# EasyEDA schematic 1-Schematic_MOBO_V3.json
TITLE: Sheet_1; REV: 1.0; Date: 2020-03-11; Sheet: 1/1; Drawn By: baddy227; Company: Your Company
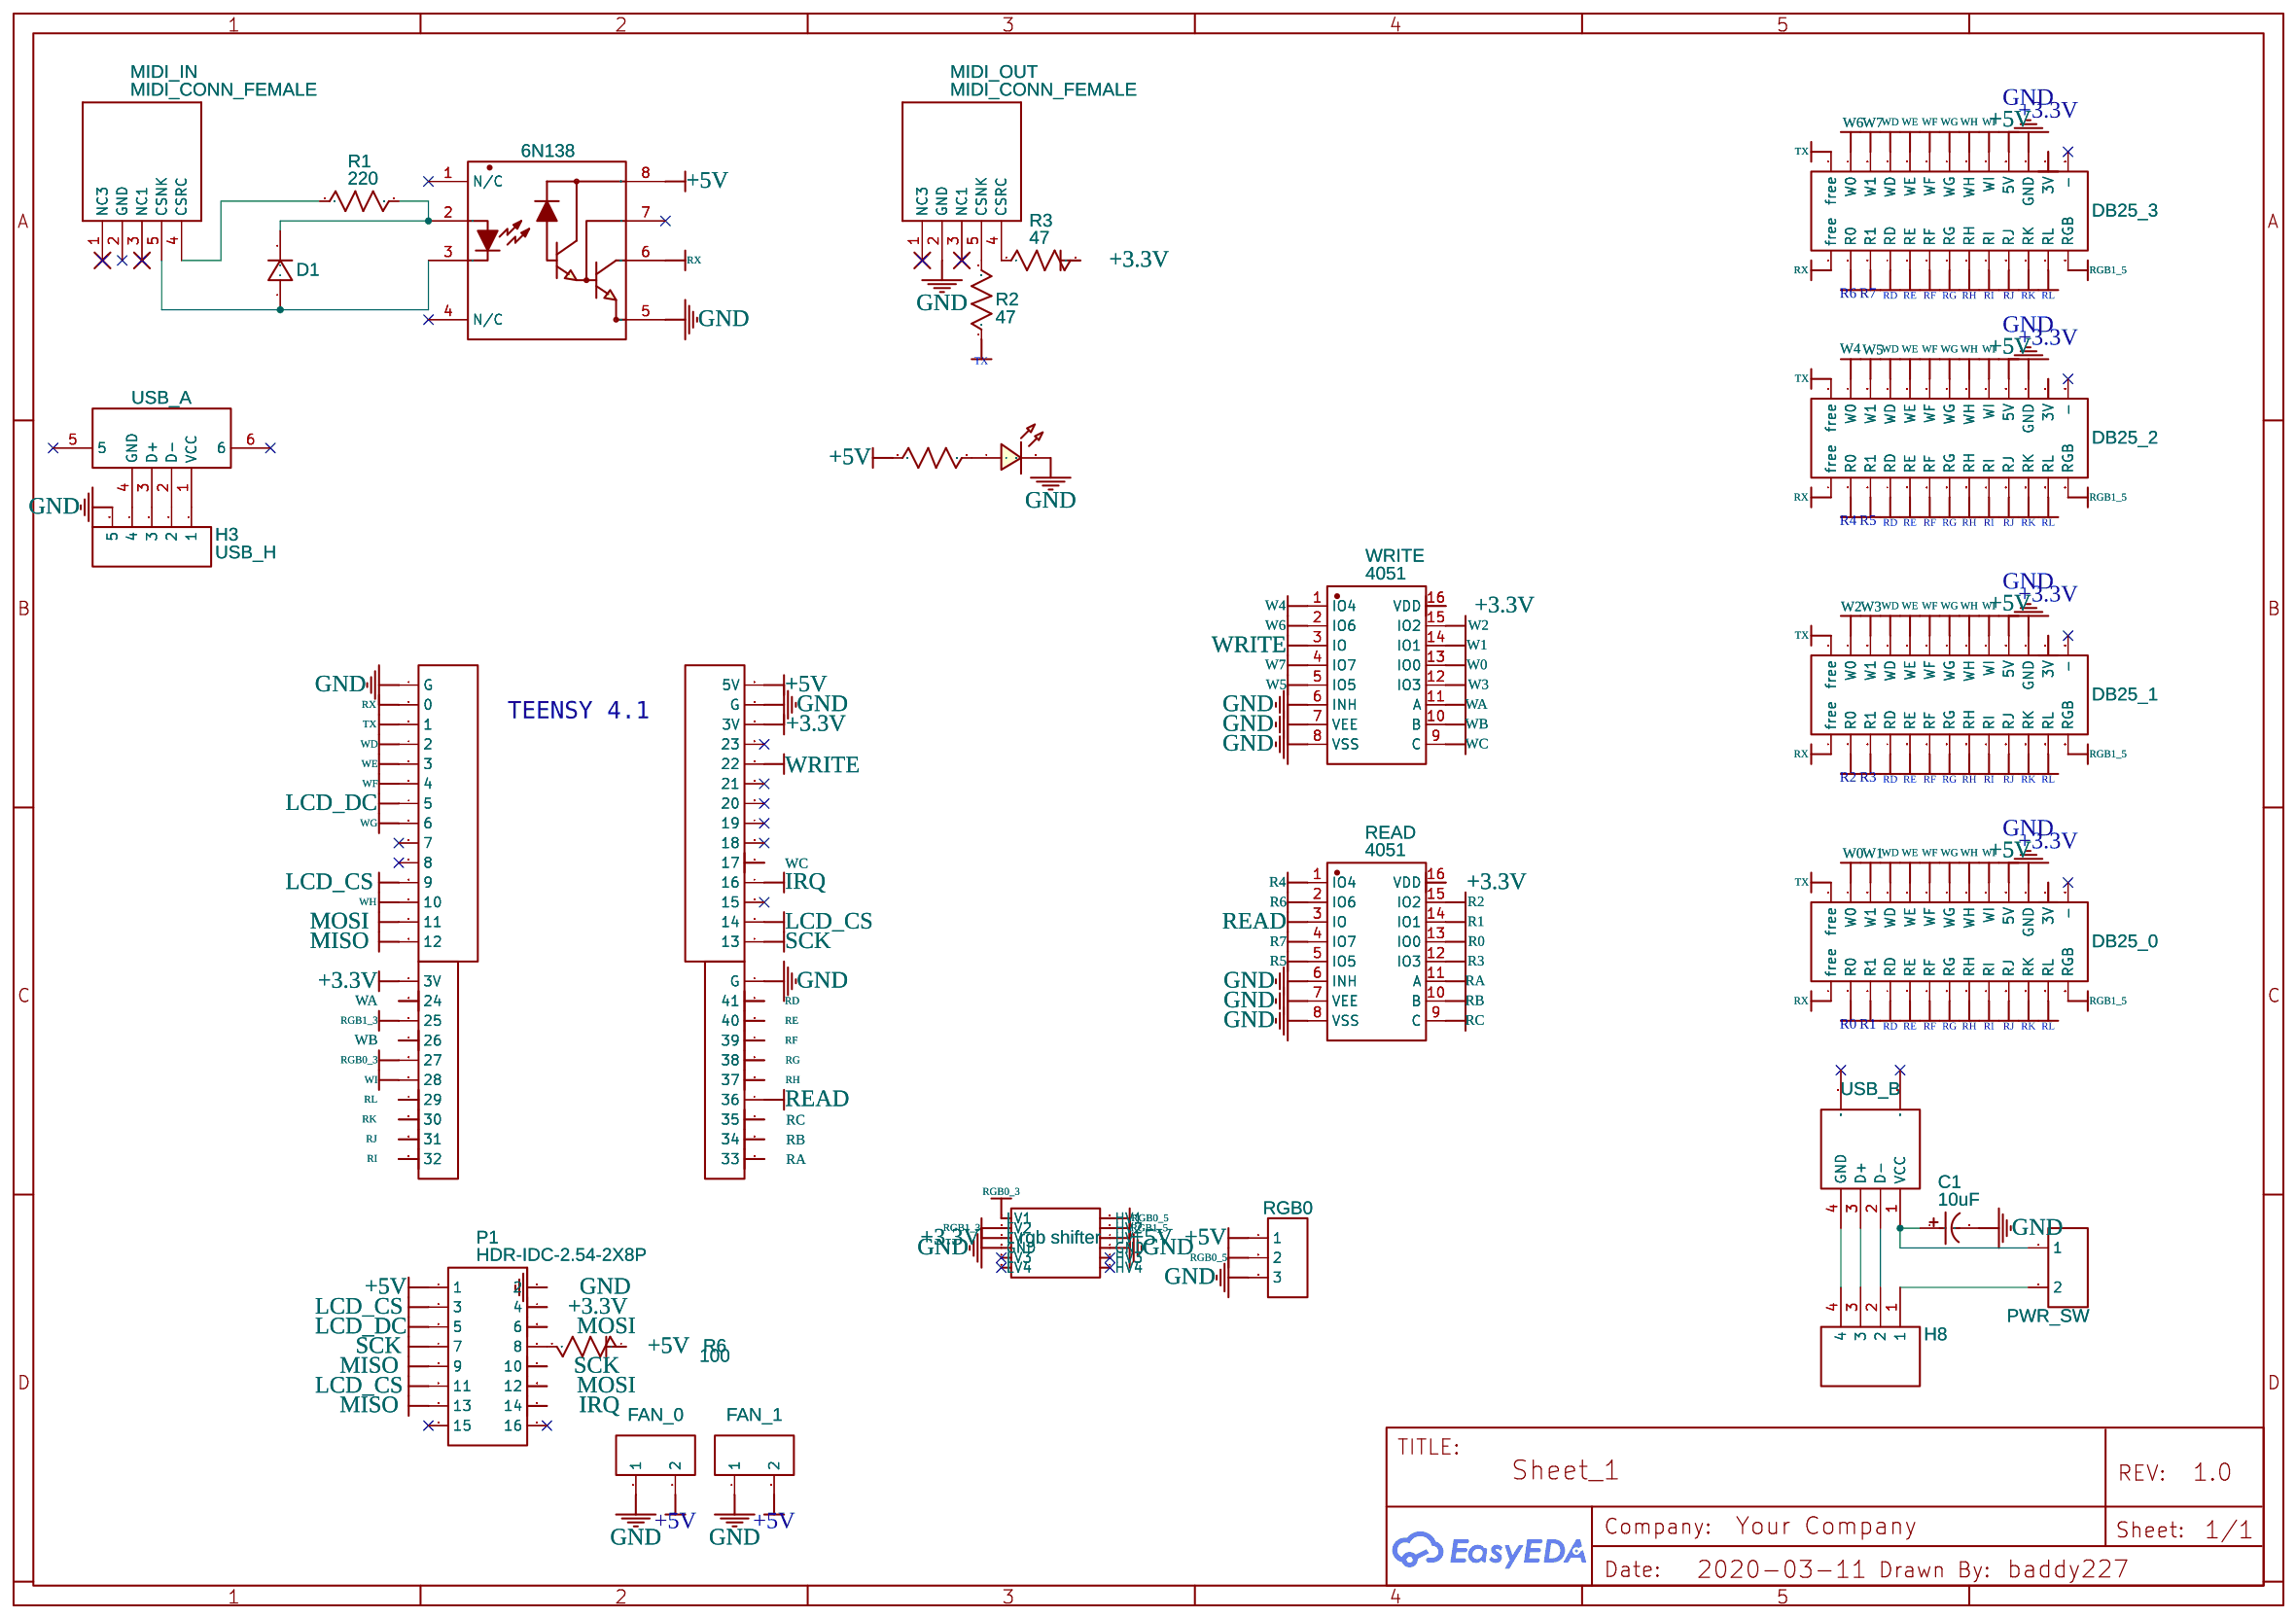
[diagram p0: schematic sheet]

## Parts
6N138  6N138  [DIP-8_L9.8-W6.6-P2.54-LS7.6-BL]
C1  10uF  [CAP-TH_BD5.0-P2.5-D0.5-FD]
D1  1N4448  [DO-35]
DB25_0  HDR-IDC-2.54-2X13P  [HDR-IDC-2.54-2X13P]
DB25_1  HDR-IDC-2.54-2X13P  [HDR-IDC-2.54-2X13P]
DB25_2  HDR-IDC-2.54-2X13P  [HDR-IDC-2.54-2X13P]
DB25_3  HDR-IDC-2.54-2X13P  [HDR-IDC-2.54-2X13P]
FAN_0  Header-Male-2.54_1x2  [HDR-2X1/2.54]
FAN_1  Header-Male-2.54_1x2  [HDR-2X1/2.54]
H1  HDR-F-2.54_1x10  [HDR-F-2.54_1X10]
H2  HDR-F-2.54_1x10  [HDR-F-2.54_1X10]
H3  USB_H  [HDR-F-2.54_1X5]
H8  220S-1*4P H=8.5MM Ytype Gold-plated  [DIP-1X4P2.54]
LED1  LED-TH-3mm_R  [LED-TH_BD3.0_RED]
MIDI_IN  MIDI_CONN_FEMALE  [DIN_5_FEMALE]
MIDI_OUT  MIDI_CONN_FEMALE  [DIN_5_FEMALE]
P1  HDR-IDC-2.54-2X8P  [IDC-TH_16P-P2.54_C3406]
PWR_SW  Header-Male-2.54_1x2  [HDR-2X1/2.54]
R1  220  [AXIAL-0.3]
R2  47  [AXIAL-0.3]
R3  47  [AXIAL-0.3]
R4  1k  [R_AXIAL-0.3]
R6  100  [R_AXIAL-0.3]
READ  4051  [DIP-16_L20.0-W6.4-P2.54-LS7.6-BL]
RGB0  Header-Male-2.54_1x3  [HDR-TH_3P-P2.54-V]
T0  Female header 2.54-1*14P  [HDR-TH_14P-P2.54-V]
T1  Female header 2.54-1*14P  [HDR-TH_14P-P2.54-V]
U1  rgb shifter  [4 CHANNEL LOGIC LEVEL SHIFTER BSS138]
USB_A  USB-AF-90-13.6X14.4-H6.95  [USB-A-TH_C42628]
USB_B  USB-B-Female-TH_C46393  [USB-B_4PIN-FEMALE_BF90]
WRITE  4051  [DIP-16_L20.0-W6.4-P2.54-LS7.6-BL]

## Library data of the parts
6N138 = 6N138: Supplier: LCSC; Supplier Part: C255743; Manufacturer: Isocom Components; Contributor: LCSC
C1 = C10uF63V2.5mm5x11mm: Supplier: LCSC; Manufacturer: ReliaPro; Supplier Part: C32455
D1 = 1N4448: Supplier: LCSC; Manufacturer: SEMTECH; image: //image.lceda.cn/szlcsc/C54037.jpg; Supplier Part: C54037
DB25_0-DB25_3 = HDR-IDC-2.54-2X13P: Supplier: LCSC; Manufacturer Part: IDC Box 2.54mm 2X13P Straight; Contributor: LCSC
FAN_0 FAN_1 PWR_SW = Header-Male-2.54_1x2: Supplier: LCSC; Manufacturer: TE Connectivity; Manufacturer Part: 826629-2; image: //image.lceda.cn/szlcsc/C86471.jpg; Supplier Part: C86471
H1 H2 = HDR-F-2.54_1x10: Supplier Part: C35445; Supplier: LCSC; Contributor: LCEDA_Lib
H3 = HDR-F-2.54_1x5: Supplier Part: C50950; Supplier: LCSC; Contributor: LCEDA_Lib
H8 = 220S-1*4P H=8.5MM Ytype Gold-plated: Supplier: LCSC; Manufacturer: Ckmtw; Contributor: LCSC; Supplier Part: C124413
LED1 = LED-TH-3mm_R: Manufacturer: EVERLIGHT(台湾亿光); Manufacturer Part: 204-10SDRD/S530-A3-L; Supplier Part: C84774; Supplier: LCSC; Contributor: LCEDA_Lib
MIDI_IN MIDI_OUT = MIDI_CONN_FEMALE: MIDI connector, no strain relieve (DIN-5 female); Contributor: SparkFun
P1 = HDR-IDC-2.54-2X8P: Supplier: LCSC; Manufacturer: BOOMELE; Manufacturer Part: IDC Box 2.54mm 16P　Straight; image: //image.lceda.cn/szlcsc/C3406.jpg; Supplier Part: C3406
R1-R3 = Res_AXIAL-0.3(1/8W)_US
R4 R6 = R_AXIAL-0.3_US: Contributor: LCEDA_Lib
READ WRITE = CD4051BE: Supplier: LCSC; Manufacturer: TI; image: //image.lceda.cn/szlcsc/C5200.jpg; Supplier Part: C5200
RGB0 = Header-Male-2.54_1x3: Supplier: LCSC; Manufacturer: BOOMELE; Manufacturer Part: Header2.54mm 1*3P; image: //image.lceda.cn/szlcsc/C49257.jpg; Supplier Part: C49257
T0 T1 = Female header 2.54-1*14P: Supplier: LCSC; Manufacturer: BOOMELE; Supplier Part: C52711
U1 = 4 channel logic level shifter bss138: Contributor: abhishek.kool.777
USB_A = USB-AF-90-13.6X14.4-H6.95: Supplier: LCSC; Supplier Part: C42628; Manufacturer: LCSC; Contributor: LCSC
USB_B = USB-B-Female-TH_C46393: Supplier: LCSC; Manufacturer Part: USB-B-Female-90-TH; image: //image.lceda.cn/szlcsc/C46393.jpg; Supplier Part: C46393

## Nets
+3.3V: DB25_0.24(3V) DB25_1.24(3V) DB25_2.24(3V) DB25_3.24(3V) H1.1(3V) P1.4 R3.2 READ.16(VDD) T1.12(3V) U1.9(LV) WRITE.16(VDD)
+5V: 6N138.8(VCC) DB25_0.20(5V) DB25_1.20(5V) DB25_2.20(5V) DB25_3.20(5V) FAN_0.2 FAN_1.2 P1.1 R4.1 R6.1 RGB0.1 T1.14(5V) U1.4(HV)
GND: 6N138.5(GND) C1.2 DB25_0.22(GND) DB25_1.22(GND) DB25_2.22(GND) DB25_3.22(GND) FAN_0.1 FAN_1.1 H2.1(G) H3.5 LED1.2 MIDI_OUT.2(GND) P1.2 READ.6(INH) READ.7(VEE) READ.8(VSS) RGB0.3 T0.1(G) T1.13(G) U1.3(GND) U1.10(GND) WRITE.6(INH) WRITE.7(VEE) WRITE.8(VSS)
IRQ: P1.14 T1.4(16)
LCD_CS: P1.3 P1.11 T0.11(9) T1.2(14)
LCD_DC: P1.5 T0.7(5)
MISO: P1.9 P1.13 T0.14(12)
MOSI: P1.6 P1.12 T0.13(11)
R0: DB25_0.3(R0) READ.13(IO0)
R1: DB25_0.5(R1) READ.14(IO1)
R2: DB25_1.3(R0) READ.15(IO2)
R3: DB25_1.5(R1) READ.12(IO3)
R4: DB25_2.3(R0) READ.1(IO4)
R5: DB25_2.5(R1) READ.5(IO5)
R6: DB25_3.3(R0) READ.2(IO6)
R7: DB25_3.5(R1) READ.4(IO7)
RA: H2.10(33) READ.11(A)
RB: H2.9(34) READ.10(B)
RC: H2.8(35) READ.9(C)
RD: DB25_0.7(RD) DB25_1.7(RD) DB25_2.7(RD) DB25_3.7(RD) H2.2(41)
RE: DB25_0.9(RE) DB25_1.9(RE) DB25_2.9(RE) DB25_3.9(RE) H2.3(40)
READ: H2.7(36) READ.3(IO)
RF: DB25_0.11(RF) DB25_1.11(RF) DB25_2.11(RF) DB25_3.11(RF) H2.4(39)
RG: DB25_0.13(RG) DB25_1.13(RG) DB25_2.13(RG) DB25_3.13(RG) H2.5(38)
RGB0_3: H1.5(27) U1.7(LV1)
RGB0_5: RGB0.2 U1.6(HV1)
RGB1_3: H1.3(25) U1.8(LV2)
RGB1_5: DB25_0.25(RGB) DB25_1.25(RGB) DB25_2.25(RGB) DB25_3.25(RGB) U1.5(HV2)
RH: DB25_0.15(RH) DB25_1.15(RH) DB25_2.15(RH) DB25_3.15(RH) H2.6(37)
RI: DB25_0.17(RI) DB25_1.17(RI) DB25_2.17(RI) DB25_3.17(RI) H1.10(32)
RJ: DB25_0.19(RJ) DB25_1.19(RJ) DB25_2.19(RJ) DB25_3.19(RJ) H1.9(31)
RK: DB25_0.21(RK) DB25_1.21(RK) DB25_2.21(RK) DB25_3.21(RK) H1.8(30)
RL: DB25_0.23(RL) DB25_1.23(RL) DB25_2.23(RL) DB25_3.23(RL) H1.7(29)
RX: 6N138.6(VOUT) DB25_0.1(free) DB25_1.1(free) DB25_2.1(free) DB25_3.1(free) T0.2(0)
SCK: P1.7 P1.10 T1.1(13)
TX: DB25_0.2(free) DB25_1.2(free) DB25_2.2(free) DB25_3.2(free) R2.1 T0.3(1)
W0: DB25_0.4(W0) WRITE.13(IO0)
W1: DB25_0.6(W1) WRITE.14(IO1)
W2: DB25_1.4(W0) WRITE.15(IO2)
W3: DB25_1.6(W1) WRITE.12(IO3)
W4: DB25_2.4(W0) WRITE.1(IO4)
W5: DB25_2.6(W1) WRITE.5(IO5)
W6: DB25_3.4(W0) WRITE.2(IO6)
W7: DB25_3.6(W1) WRITE.4(IO7)
WA: H1.2(24) WRITE.11(A)
WB: H1.4(26) WRITE.10(B)
WC: T1.5(17) WRITE.9(C)
WD: DB25_0.8(WD) DB25_1.8(WD) DB25_2.8(WD) DB25_3.8(WD) T0.4(2)
WE: DB25_0.10(WE) DB25_1.10(WE) DB25_2.10(WE) DB25_3.10(WE) T0.5(3)
WF: DB25_0.12(WF) DB25_1.12(WF) DB25_2.12(WF) DB25_3.12(WF) T0.6(4)
WG: DB25_0.14(WG) DB25_1.14(WG) DB25_2.14(WG) DB25_3.14(WG) T0.8(6)
WH: DB25_0.16(WH) DB25_1.16(WH) DB25_2.16(WH) DB25_3.16(WH) T0.12(10)
WI: DB25_0.18(WI) DB25_1.18(WI) DB25_2.18(WI) DB25_3.18(WI) H1.6(28)
WRITE: T1.10(22) WRITE.3(IO)
Net-(6N138-2): 6N138.2(A) D1.2(K) R1.2
Net-(6N138-3): 6N138.3(C) D1.1(A) MIDI_IN.5(CSNK)
Net-(C1-1): C1.1 PWR_SW.1 USB_B.1(VCC)
Net-(H3-1): H3.1 USB_A.1(VCC)
Net-(H3-2): H3.2 USB_A.2(D-)
Net-(H3-3): H3.3 USB_A.3(D+)
Net-(H3-4): H3.4 USB_A.4(GND)
Net-(H8-1): H8.1 PWR_SW.2
Net-(H8-2): H8.2 USB_B.2(D-)
Net-(H8-3): H8.3 USB_B.3(D+)
Net-(H8-4): H8.4 USB_B.4(GND)
Net-(LED1-1): LED1.1 R4.2
Net-(MIDI_IN-4): MIDI_IN.4(CSRC) R1.1
Net-(MIDI_OUT-4): MIDI_OUT.4(CSRC) R3.1
Net-(MIDI_OUT-5): MIDI_OUT.5(CSNK) R2.2
Net-(P1-8): P1.8 R6.2

Not connected (* = marked no-connect by the designer): 6N138 1(N/C)* 4(N/C)* 7(VB)*; DB25_0 26(-)*; DB25_1 26(-)*; DB25_2 26(-)*; DB25_3 26(-)*; MIDI_IN 1(NC3)* 2(GND)* 3(NC1)*; MIDI_OUT 1(NC3)* 3(NC1)*; P1 15* 16*; T0 9(7)* 10(8)*; T1 3(15)* 6(18)* 7(19)* 8(20)* 9(21)* 11(23)*; U1 1(HV4)* 2(HV3)* 11(LV3)* 12(LV4)*; USB_A 5* 6*; USB_B SH1* SH2*

## Notes on the sheet
- TEENSY 4.1
